# Altium project f103ret6_w25q64_20210714.PrjPcb
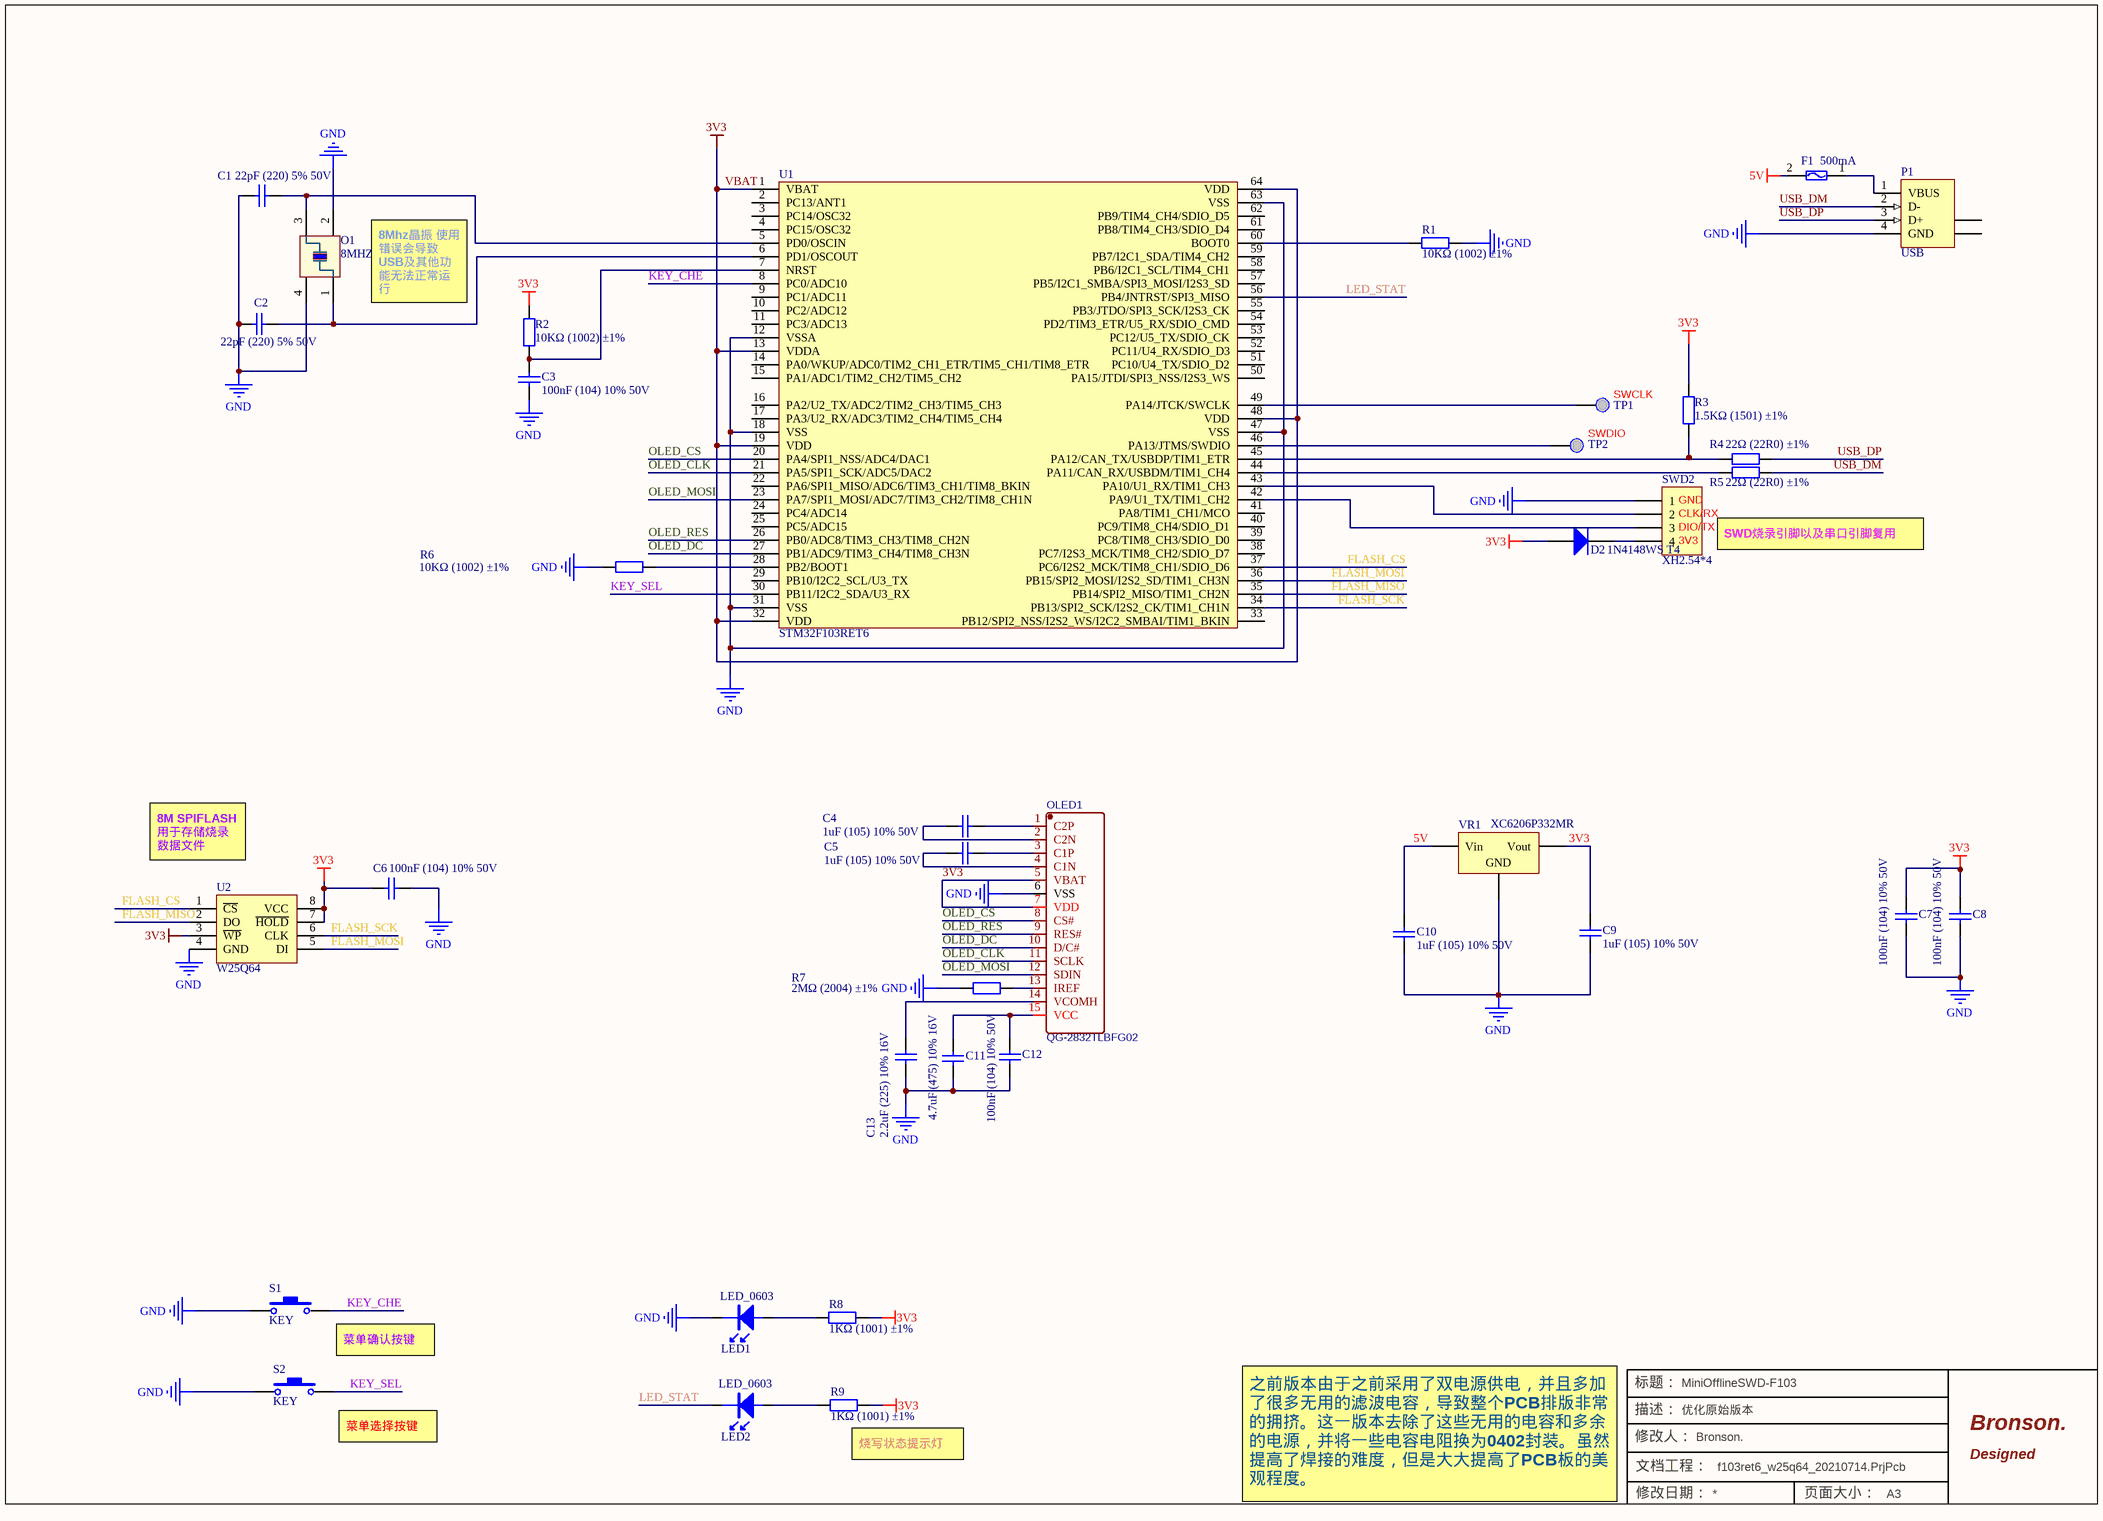
[diagram p0: f103ret6_w25q64_20210714.SchDoc]
1 sheet, 37 parts. Net scope: global (net labels, ports and power ports of the same name join across sheets).
Board file: f103ret6_w25q64_20210714.PcbDoc

## Sheet f103ret6_w25q64_20210714.SchDoc: MiniOfflineSWD-F103
size A3; Author: Bronson.; Address1: 优化原始版本

### Parts
C1  22pF (220) 5% 50V  [C0402]
C2  22pF (220) 5% 50V  [C0402]
C3  100nF (104) 10% 50V  [C0402]
C4  1uF (105) 10% 50V  [C0402]
C5  1uF (105) 10% 50V  [C0402]
C6  100nF (104) 10% 50V  [C0402]
C7  100nF (104) 10% 50V  [C0603]
C8  100nF (104) 10% 50V  [C0402]
C9  1uF (105) 10% 50V  [C0402]
C10  1uF (105) 10% 50V  [C0603]
C11  4.7uF (475) 10% 16V  [C0402]
C12  100nF (104) 10% 50V  [C0402]
C13  2.2uF (225) 10% 16V  [C0402]
D2  1N4148WS T4  [SOD-323]
F1  500mA  [0603]
LED1  LED_0603  [LED_0603_BLUE]
LED2  LED_0603  [LED_0603_RED]
O1  8MHZ  [3225]
OLED1  QG-2832TLBFG02  [0.91-OLED]
P1  USB  [USB_A/P_B]
R1  10KΩ (1002) ±1%  [RES0402]
R2  10KΩ (1002) ±1%  [RES0402]
R3  1.5KΩ (1501) ±1%  [RES0402]
R4  22Ω (22R0) ±1%  [RES0402]
R5  22Ω (22R0) ±1%  [RES0402]
R6  10KΩ (1002) ±1%  [RES0402]
R7  2MΩ (2004) ±1%  [RES0603]
R8  1KΩ (1001) ±1%  [RES0402]
R9  1KΩ (1001) ±1%  [RES0402]
S1  KEY  [KEY]
S2  KEY  [KEY]
SWD2  XH2.54*4  [XH2.54-WI-4P]
TP1  IO  [TP]  (value not drawn)
TP2  IO  [TP]  (value not drawn)
U1  STM32F103RET6  [LQFP64]
U2  W25Q64  [SOP8_W]
VR1  XC6206P332MR  [SOT-23-3L]

### Nets
3V3: C6.1 C7.2 C8.2 C9.2 D2.1(A) OLED1.5(VBAT) OLED1.7(VDD) R2.2 R3.1 R8.2 R9.2 U1.1(VBAT) U1.13(VDDA) U1.19(VDD) U1.32(VDD) U1.48(VDD) U1.64(VDD) U2.3(~{WP}) U2.7(~{HOLD}) U2.8(VCC) VR1.2(Vout)  [also labelled VBAT]
5V: C10.2 F1.2 VR1.3(Vin)
GND: C1.2 C2.2 C3.1 C6.2 C7.1 C8.1 C9.1 C10.1 C11.1 C12.1 C13.1 LED1.2 O1.2 O1.4 OLED1.6(VSS) P1.4(GND) R1.1 R6.1 R7.1 S1.1 S2.1 SWD2.1 U1.12(VSSA) U1.18(VSS) U1.31(VSS) U1.47(VSS) U1.63(VSS) U2.4(GND) VR1.1(GND)
FLASH_CS: U1.37(PC6/I2S2_MCK/TIM8_CH1/SDIO_D6) U2.1(~{CS})
FLASH_MISO: U1.35(PB14/SPI2_MISO/TIM1_CH2N) U2.2(DO)
FLASH_MOSI: U1.36(PB15/SPI2_MOSI/I2S2_SD/TIM1_CH3N) U2.5(DI)
FLASH_SCK: U1.34(PB13/SPI2_SCK/I2S2_CK/TIM1_CH1N) U2.6(CLK)
KEY_CHE: S1.2 U1.8(PC0/ADC10)
KEY_SEL: S2.2 U1.30(PB11/I2C2_SDA/U3_RX)
LED_STAT: LED2.2 U1.56(PB4/JNTRST/SPI3_MISO)
OLED_CLK: OLED1.11(SCLK) U1.21(PA5/SPI1_SCK/ADC5/DAC2)
OLED_CS: OLED1.8(CS#) U1.20(PA4/SPI1_NSS/ADC4/DAC1)
OLED_DC: OLED1.10(D/C#) U1.27(PB1/ADC9/TIM3_CH4/TIM8_CH3N)
OLED_MOSI: OLED1.12(SDIN) U1.23(PA7/SPI1_MOSI/ADC7/TIM3_CH2/TIM8_CH1N)
OLED_RES: OLED1.9(RES#) U1.26(PB0/ADC8/TIM3_CH3/TIM8_CH2N)
USB_DM: P1.2(D-) R5.2
USB_DP: P1.3(D+) R4.2
NetC1_1: C1.1 O1.3 U1.5(PD0/OSCIN)
NetC2_1: C2.1 O1.1 U1.6(PD1/OSCOUT)
NetC3_2: C3.2 R2.1 U1.7(NRST)
NetC4_1: C4.1 OLED1.2(C2N)
NetC4_2: C4.2 OLED1.1(C2P)
NetC5_1: C5.1 OLED1.4(C1N)
NetC5_2: C5.2 OLED1.3(C1P)
NetC11_2: C11.2 C12.2 OLED1.15(VCC)
NetC13_2: C13.2 OLED1.14(VCOMH)
NetD2_2: D2.2(K) SWD2.4
NetF1_1: F1.1 P1.1(VBUS)
NetLED1_1: LED1.1 R8.1
NetLED2_1: LED2.1 R9.1
NetOLED1_13: OLED1.13(IREF) R7.2
NetR1_2: R1.2 U1.60(BOOT0)
NetR3_2: R3.2 R4.1 U1.45(PA12/CAN_TX/USBDP/TIM1_ETR)
NetR5_1: R5.1 U1.44(PA11/CAN_RX/USBDM/TIM1_CH4)
NetR6_2: R6.2 U1.28(PB2/BOOT1)
NetSWD2_2: SWD2.2 U1.43(PA10/U1_RX/TIM1_CH3)
NetSWD2_3: SWD2.3 U1.42(PA9/U1_TX/TIM1_CH2)
NetTP1_1: TP1.1 U1.49(PA14/JTCK/SWCLK)
NetTP2_1: TP2.1 U1.46(PA13/JTMS/SWDIO)

Not connected (* = marked no-connect by the designer): P1 5(SHLD) 6(SHLD); U1 2(PC13/ANT1) 3(PC14/OSC32) 4(PC15/OSC32) 9(PC1/ADC11) 10(PC2/ADC12) 11(PC3/ADC13) 14(PA0/WKUP/ADC0/TIM2_CH1_ETR/TIM5_CH1/TIM8_ETR) 15(PA1/ADC1/TIM2_CH2/TIM5_CH2) 16(PA2/U2_TX/ADC2/TIM2_CH3/TIM5_CH3) 17(PA3/U2_RX/ADC3/TIM2_CH4/TIM5_CH4) 22(PA6/SPI1_MISO/ADC6/TIM3_CH1/TIM8_BKIN) 24(PC4/ADC14) 25(PC5/ADC15) 29(PB10/I2C2_SCL/U3_TX) 33(PB12/SPI2_NSS/I2S2_WS/I2C2_SMBAI/TIM1_BKIN) 38(PC7/I2S3_MCK/TIM8_CH2/SDIO_D7) 39(PC8/TIM8_CH3/SDIO_D0) 40(PC9/TIM8_CH4/SDIO_D1) 41(PA8/TIM1_CH1/MCO) 50(PA15/JTDI/SPI3_NSS/I2S3_WS) 51(PC10/U4_TX/SDIO_D2) 52(PC11/U4_RX/SDIO_D3) 53(PC12/U5_TX/SDIO_CK) 54(PD2/TIM3_ETR/U5_RX/SDIO_CMD) 55(PB3/JTDO/SPI3_SCK/I2S3_CK) 57(PB5/I2C1_SMBA/SPI3_MOSI/I2S3_SD) 58(PB6/I2C1_SCL/TIM4_CH1) 59(PB7/I2C1_SDA/TIM4_CH2) 61(PB8/TIM4_CH3/SDIO_D4) 62(PB9/TIM4_CH4/SDIO_D5)

### Notes on the sheet
- (near O1) 8Mhz晶振 使用错误会导致USB及其他功能无法正常运行
- SWDIO
- (near TP1) SWCLK
- (near SWD2) GND
- (near SWD2) CLK/RX
- (near SWD2) DIO/TX
- (near SWD2) 3V3
- SWD烧录引脚以及串口引脚复用
- (near U2) 8M SPIFLASH
  用于存储烧录
  数据文件
- 菜单确认按键
- (near S2) 菜单选择按键
- (near R9) 烧写状态提示灯
- 之前版本由于之前采用了双电源供电，并且多加了很多无用的滤波电容，导致整个PCB排版非常的拥挤。这一版本去除了这些无用的电容和多余的电源，并将一些电容电阻换为0402封装。虽然提高了焊接的难度，但是大大提高了PCB板的美观程度。
- 标题：
- 描述：
- 修改人：
- Bronson.
- Designed
- 文档工程：
- 修改日期：
- 页面大小：
- A3

### Library data of the parts
C1 C2 = 0603 22pF (220) 5%: 贴片电容; ComponentLink1Description: 供应商链接; ComponentLink1URL: http://www.szlcsc.com/product/details_2005.html; Package: 0603; Supplier: LC; SuppliersPartNumber: C1653
C3 C6-C8 C12 = 0603 100nF (104) 10%: 贴片电容; ComponentLink1Description: 供应商链接; ComponentLink1URL: http://www.szlcsc.com/product/details_15331.html; Package: 0603; Supplier: LC; SuppliersPartNumber: C14663
C4 C5 C9 C10 = 0603 1uF (105) 10%: 贴片电容; ComponentLink1Description: 供应商链接; ComponentLink1URL: http://www.szlcsc.com/product/details_16531.html; Package: 0603; Supplier: LC; SuppliersPartNumber: C15849
C11 = 0603 4.7uF (475) 10%: 贴片电容; ComponentLink1Description: 供应商链接; ComponentLink1URL: http://www.szlcsc.com/product/details_20375.html; Package: 0603; Supplier: LC; SuppliersPartNumber: C19666
C13 = 0603 2.2uF (225) 10%: 贴片电容; ComponentLink1Description: 供应商链接; ComponentLink1URL: http://www.szlcsc.com/product/details_24366.html; Package: 0603; Supplier: LC; SuppliersPartNumber: C23630
D2 = SOD-323 1N4148WS T4: 二极管; ComponentLink1Description: 供应商链接; ComponentLink1URL: http://www.szlcsc.com/product/details_2485.html; Package: SOD-323; Supplier: LC; SuppliersPartNumber: C2128
F1 = FUSE: 保险丝，熔断丝
LED1 LED2 = LED
O1 = OSC
OLED1 = 0.91-OLED: BOM_Manufacturer: Allvision; Contributor: LCSC; BOM_Supplier: LCSC; BOM_Manufacturer Part: QG-2832TLBFG02; BOM_Supplier Part: C91220; spicePre: O; spiceSymbolName: QG-2832TLBFG02
P1 = 1470695-2: USB 1.1, Right Angle, SMT, A Type, Plug, 4 Position, Natural; ContactMaterial: Brass; ContactPlating: Gold (30) over Nickel (50); PCB_Layout: Complies with manufacturer's recommendation.; DrillSize: Corresponds to nominal value.; PanelGround: Without; Published: 15-Jul-2004; DatasheetDocument: 21-Jan-2003; PackageDocument: 21-Jan-2003; PackageReference: 1470695A; Publisher: Altium Limited; HousingMaterial: Thermoplastic; ComponentLink1Description: Manufacturer Link; ComponentLink1URL: http://www.tycoelectronics.com/; ComponentLink2Description: Packaging Specification; ComponentLink2URL: http://ecommas.tycoelectronics.com/commerce/DocumentDelivery/DDEController?Action=showdoc&DocId=Customer+Drawing%7F1470695%7FO%7Fpdf%7FEnglish%7FC_1470695_O.pdf
R1 R2 R6 = 0603 10KΩ (10: 贴片电阻; ComponentLink1Description: 供应商链接; ComponentLink1URL: http://www.szlcsc.com/product/details_26547.html; Package: 0603; Supplier: LC; SuppliersPartNumber: C25804
R3 = 0603 1.5KΩ (15: 贴片电阻; ComponentLink1Description: 供应商链接; ComponentLink1URL: http://www.szlcsc.com/product/details_23570.html; Package: 0603; Supplier: LC; SuppliersPartNumber: C22843
R4 R5 = 0603 22Ω (22: 贴片电阻; ComponentLink1Description: 供应商链接; ComponentLink1URL: http://www.szlcsc.com/product/details_24078.html; Package: 0603; Supplier: LC; SuppliersPartNumber: C23345
R7 = 0603 2MΩ (20: 贴片电阻; ComponentLink1Description: 供应商链接; ComponentLink1URL: http://www.szlcsc.com/product/details_23703.html; Package: 0603; Supplier: LC; SuppliersPartNumber: C22976
R8 R9 = 0603 1KΩ (10: 贴片电阻; ComponentLink1Description: 供应商链接; ComponentLink1URL: http://www.szlcsc.com/product/details_21904.html; Package: 0603; Supplier: LC; SuppliersPartNumber: C21190
SWD2 = Header 4: Header, 4-Pin; LatestRevisionDate: 17-Jul-2002; LatestRevisionNote: Re-released for DXP Platform.; Publisher: Altium Limited
TP1 TP2 = TP_SMD: Source Path: H:\MISSION\FORLINX\LIB\ORCAD_SCH\MYLIB_20130328.OLB; Value: TP_SMD; PCB DECAL: TP_SMD
U1 = STM32F103RxT6
U2 = W25Q
VR1 = SOT-23 XC620: 低压差线性稳压(LDO); ComponentLink1Description: 供应商链接; ComponentLink1URL: http://www.szlcsc.com/product/details_5896.html; Package: SOT-23; Supplier: LC; SuppliersPartNumber: C5446